# EasyEDA schematic WideBandO2.schematic.easyeda.json
TITLE: Sheet_1; REV: 1.0; Date: 2021-01-20; Sheet: 1/1; Drawn By: meabru; Company: Your Company
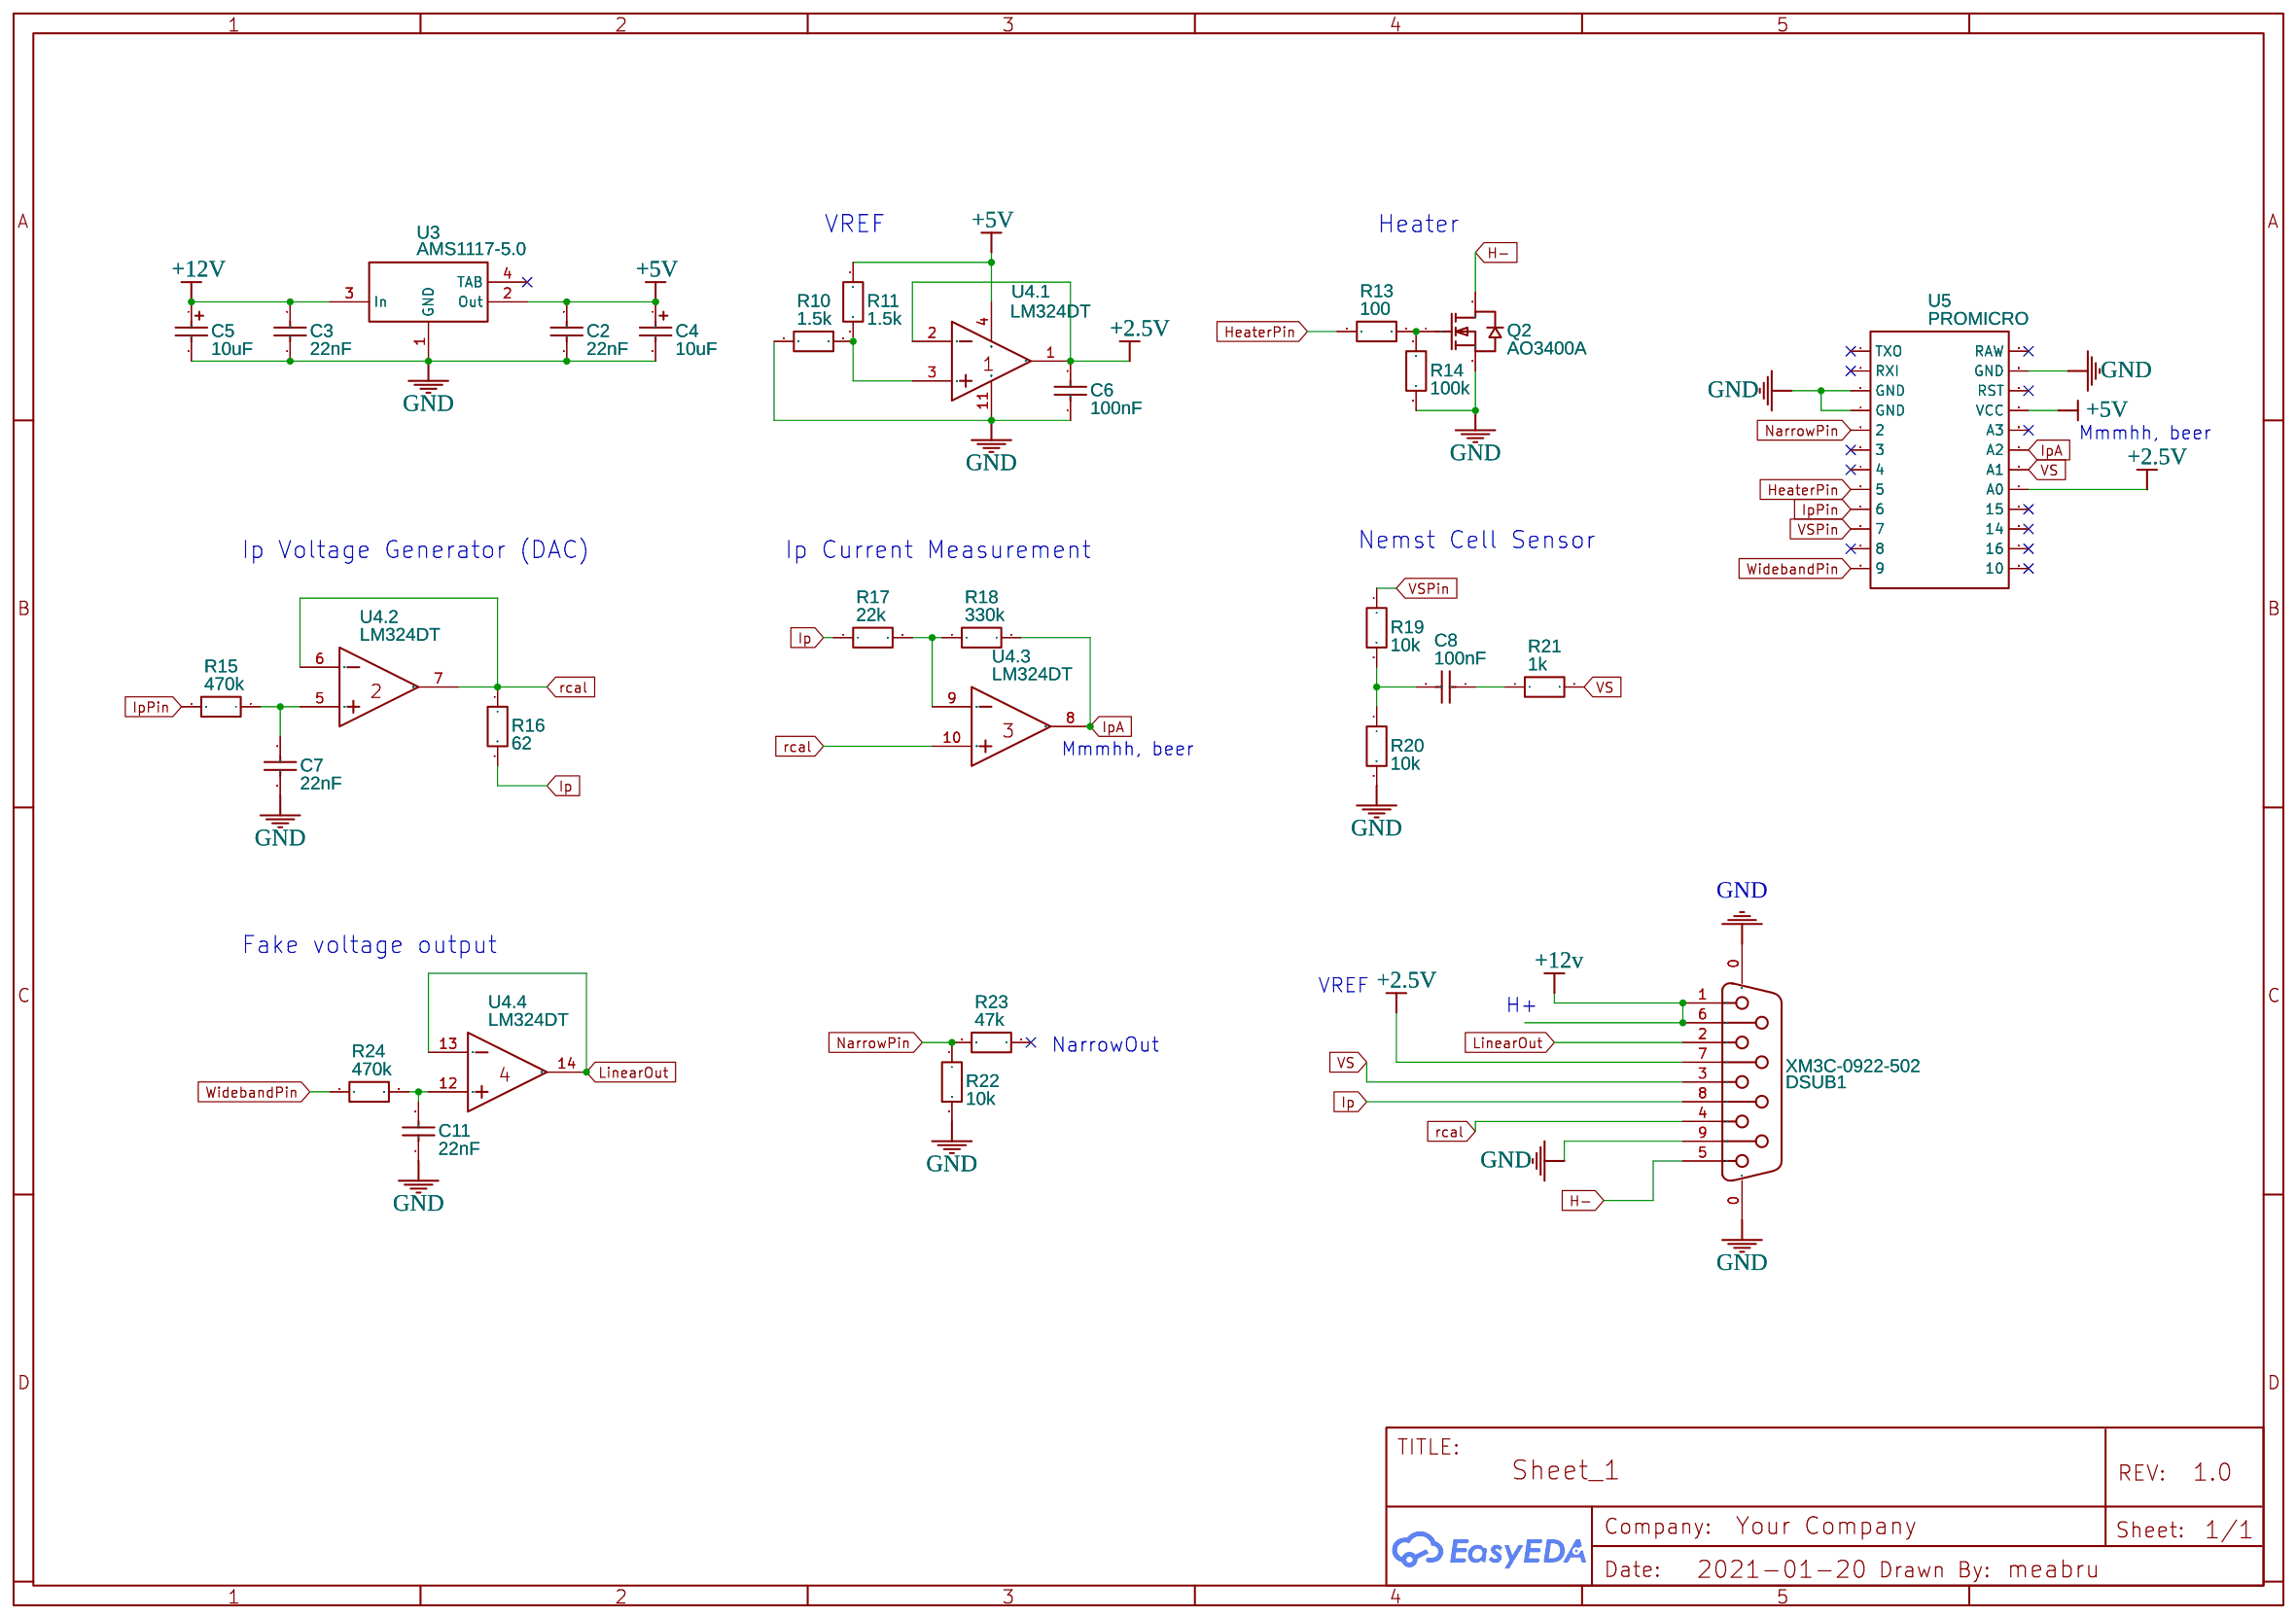
[diagram p0: schematic sheet]

## Parts
C2  22nF  [C0402]
C3  22nF  [C0402]
C4  10uF  [CAP-SMD_L3.2-W1.6-R-RD]
C5  10uF  [CAP-SMD_L3.2-W1.6-R-RD]
C6  100nF  [C0402]
C7  22nF  [C0402]
C8  100nF  [C0402]
C11  22nF  [C0402]
DSUB1  XM3C-0922-502  [DSUB-TH_9P-P2.74-S2.84_L18.5-W30.8-G]
Q2  AO3400A  [SOT-23-3_L2.9-W1.6-P1.90-LS2.8-BR]
R10  1.5k  [R0603]
R11  1.5k  [R0603]
R13  100  [R0603]
R14  100k  [R0603]
R15  470k  [R0603]
R16  62  [R0603]
R17  22k  [R0603]
R18  330k  [R0603]
R19  10k  [R0603]
R20  10k  [R0603]
R21  1k  [R0603]
R22  10k  [R0603]
R23  47k  [R0603]
R24  470k  [R0603]
U3  AMS1117-5.0  [SOT-223_L6.5-W3.5-P2.30-LS7.0-BR]
U4  LM324DT  [SOIC-14_L8.7-W3.9-P1.27-LS6.0-BL]  (sections 1,2,3,4)
U5  PROMICRO  [PROMICRO]

## Library data of the parts
C2 C3 C7 C11 = 0402B223K500NT: Supplier: LCSC; Manufacturer: FH; Supplier Part: C1532; SMT Type: Basic; JLCPCB SMD: Yes; LCSC Assembly: Yes
C4 C5 = TAJA106K016RNJ: Supplier: LCSC; Manufacturer: AVX; Supplier Part: C7171; SMT Type: Basic; JLCPCB SMD: Yes; LCSC Assembly: Yes
C6 C8 = CL05B104KO5NNNC: Supplier: LCSC; Manufacturer: SAMSUNG; Supplier Part: C1525; SMT Type: Basic; JLCPCB SMD: Yes; LCSC Assembly: Yes
DSUB1 = XM3C-0922-502: Supplier: LCSC; Supplier Part: C231482; Manufacturer: Omron Electronics; Contributor: LCSC; LCSC Assembly: Yes; SMT Type: Extend
Q2 = AO3400A: Supplier: LCSC; Manufacturer: AOS; image: //image.lceda.cn/szlcsc/C20917.jpg; Supplier Part: C20917; SMT Type: Basic; JLCPCB SMD: Yes; LCSC Assembly: Yes
R10 R11 R13-R24 = R_AXIAL-0.3_EU: Contributor: LCEDA_Lib
U3 = AMS1117-5.0: sourceId: HltLFyQwq; Supplier: LCSC; Manufacturer: AMS; image: //image.lceda.cn/szlcsc/C6187.jpg; Supplier Part: C6187; SMT Type: Basic; JLCPCB SMD: Yes; LCSC Assembly: Yes
U4 = LM324DT: Supplier: LCSC; Manufacturer: STMicroelectronics; image: //image.lceda.cn/szlcsc/C71035.jpg; Supplier Part: C71035; SMT Type: Basic; subpart_no: 2; JLCPCB SMD: Yes
U5 = PROMICRO: Contributor: cjameszhang

## Nets
+2.5V: C6.2 DSUB1.7 U4.1(OUT1) U4.2(IN1-) U5.17(A0)
+5V: C2.2 C4.1 R11.1 U3.2(Out) U4.4(VCC+) U5.21(VCC)
+12V: C3.2 C5.1 U3.3(In)
+12v: DSUB1.1 DSUB1.6
GND: C2.1 C3.1 C4.2 C5.2 C6.1 C7.1 C11.1 DSUB1.0 DSUB1.9 Q2.2(S) R10.2 R14.2 R20.2 R22.2 U3.1(GND) U4.11(VCC-) U5.3(GND) U5.4(GND) U5.23(GND)
H-: DSUB1.5 Q2.3(D)
HeaterPin: R13.2 U5.8(5)
Ip: DSUB1.8 R16.2 R17.1
IpA: R18.2 U4.8(OUT3) U5.19(A2)
IpPin: R15.2 U5.9(6)
LinearOut: DSUB1.2 U4.13(IN4-) U4.14(OUT4)
NarrowPin: R22.1 R23.2 U5.5(2)
rcal: DSUB1.4 R16.1 U4.6(IN2-) U4.7(OUT2) U4.10(IN3+)
VS: DSUB1.3 R21.2 U5.18(A1)
VSPin: R19.1 U5.10(7)
WidebandPin: R24.1 U5.12(9)
Net-(C7-2): C7.2 R15.1 U4.5(IN2+)
Net-(C8-1): C8.1 R21.1
Net-(C8-2): C8.2 R19.2 R20.1
Net-(C11-2): C11.2 R24.2 U4.12(IN4+)
Net-(Q2-1): Q2.1(G) R13.1 R14.1
Net-(R10-1): R10.1 R11.2 U4.3(IN1+)
Net-(R17-2): R17.2 R18.1 U4.9(IN3-)

Not connected (* = marked no-connect by the designer): R23 1*; U3 4(TAB)*; U5 1(TXO)* 2(RXI)* 6(3)* 7(4)* 11(8)* 13(10)* 14(16)* 15(14)* 16(15)* 20(A3)* 22(RST)* 24(RAW)*

## Notes on the sheet
- VREF
- Heater
- Mmmhh, beer
- Nemst Cell Sensor
- Ip Voltage Generator (DAC)
- Ip Current Measurement
- Mmmhh, beer
- Fake voltage output
- VREF
- H+
- NarrowOut
